# Altium project Skumpad.PrjPcb
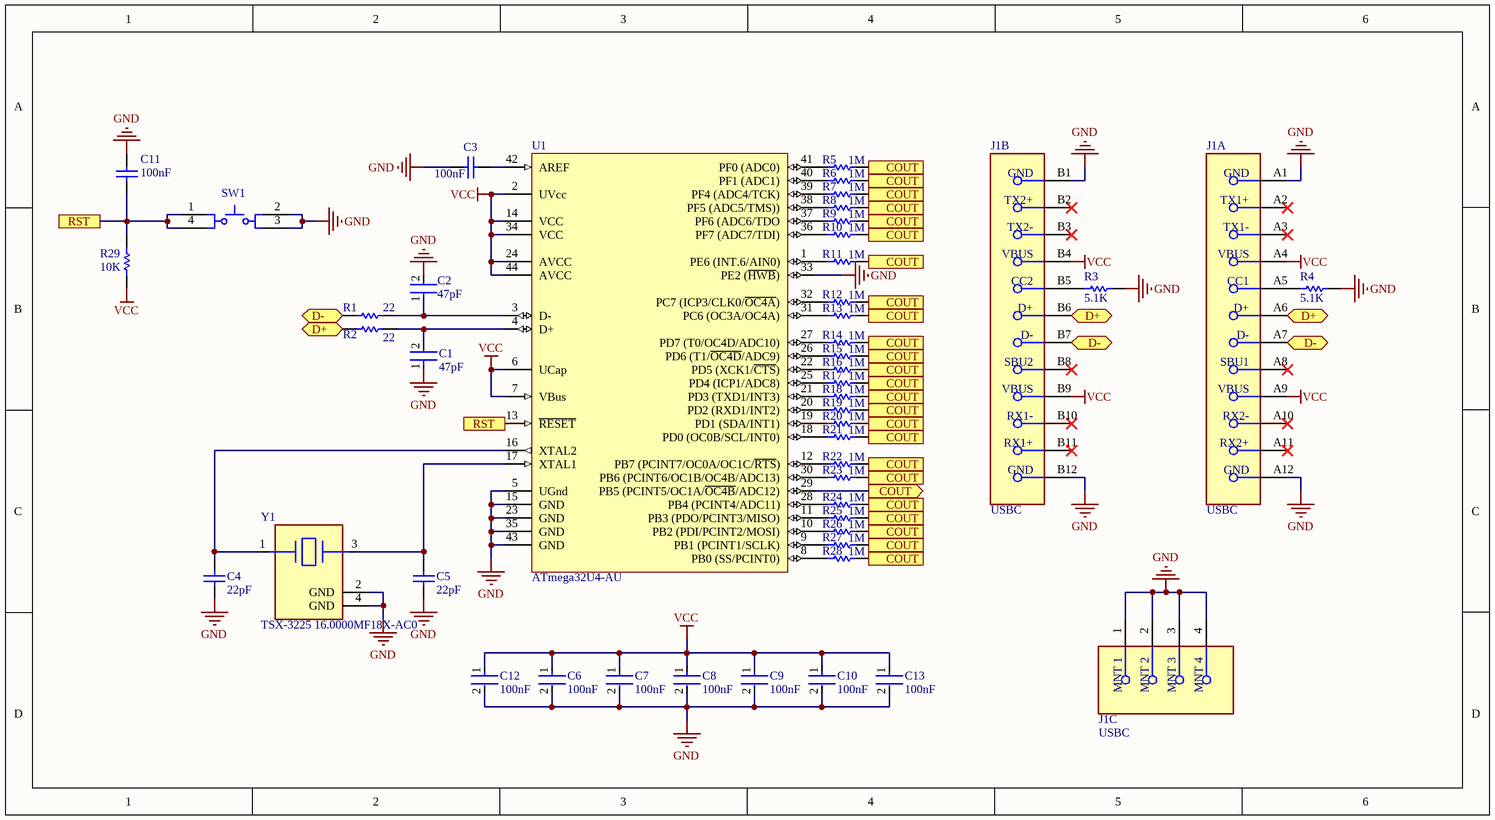
[diagram p0: Skumpad.SchDoc]
3 sheets, 118 parts. Net scope: hierarchical (ports join the sheet entries above them; power ports are global).
Board file: Skumpad.PcbDoc
Sheets:
  Skumpad.SchDoc
  Layout.SchDoc
    NUM = CSensor.SchDoc
    DIV = CSensor.SchDoc
    MUL = CSensor.SchDoc
    SUB = CSensor.SchDoc
    NUM = CSensor.SchDoc
    7 = CSensor.SchDoc
    8 = CSensor.SchDoc
    9 = CSensor.SchDoc
    ADD = CSensor.SchDoc
    a = CSensor.SchDoc
    4 = CSensor.SchDoc
    5 = CSensor.SchDoc
    6 = CSensor.SchDoc
    g = CSensor.SchDoc
    b = CSensor.SchDoc
    1 = CSensor.SchDoc
    2 = CSensor.SchDoc
    3 = CSensor.SchDoc
    ENT = CSensor.SchDoc
    c = CSensor.SchDoc
    d = CSensor.SchDoc
    e = CSensor.SchDoc
    f = CSensor.SchDoc
    DEL = CSensor.SchDoc

## Sheet Skumpad.SchDoc
size 279 x 152 mm; ApprovedBy: Skaytacium; CheckedBy: NNNI; Author: Skaytacium; CompanyName: Skaytacium Inc.; Organization: Skaytacium Inc.; DocumentNumber: Skumpad; Revision: 3

### Parts
C1  47pF  [FP-C0402-BB-MFG]
C2  47pF  [FP-C0402-BB-MFG]
C3  100nF  [CAPC1050X55X23ML05T13]
C4  22pF  [CAPC1005X56X25NL10T15]
C5  22pF  [CAPC1005X56X25NL10T15]
C6  100nF  [FP-C0402-BB-MFG]
C7  100nF  [FP-C0402-BB-MFG]
C8  100nF  [FP-C0402-BB-MFG]
C9  100nF  [FP-C0402-BB-MFG]
C10  100nF  [FP-C0402-BB-MFG]
C11  100nF  [CAPC1050X55X23ML05T13]
C12  100nF  [FP-C0402-BB-MFG]
C13  100nF  [FP-C0402-BB-MFG]
J1  USBC  [FP-1054500101-MFG]  (parts A,B,C of 3)
R1  22  [RESC1005X40X25LL05T05]
R2  22  [RESC1005X40X25LL05T05]
R3  5.1K  [RESC1005X40X25NL10T10]
R4  5.1K  [RESC1005X40X25NL10T10]
R5  1M  [RESC0402(1005)_M]
R6  1M  [RESC0402(1005)_M]
R7  1M  [RESC0402(1005)_M]
R8  1M  [RESC0402(1005)_M]
R9  1M  [RESC0402(1005)_M]
R10  1M  [RESC0402(1005)_M]
R11  1M  [RESC0402(1005)_M]
R12  1M  [RESC0402(1005)_M]
R13  1M  [RESC0402(1005)_M]
R14  1M  [RESC0402(1005)_M]
R15  1M  [RESC0402(1005)_M]
R16  1M  [RESC0402(1005)_M]
R17  1M  [RESC0402(1005)_M]
R18  1M  [RESC0402(1005)_M]
R19  1M  [RESC0402(1005)_M]
R20  1M  [RESC0402(1005)_M]
R21  1M  [RESC0402(1005)_M]
R22  1M  [RESC0402(1005)_M]
R23  1M  [RESC0402(1005)_M]
R24  1M  [RESC0402(1005)_M]
R25  1M  [RESC0402(1005)_M]
R26  1M  [RESC0402(1005)_M]
R27  1M  [RESC0402(1005)_M]
R28  1M  [RESC0402(1005)_M]
R29  10K  [RESC1005X40X25NL05T05]
SW1  7914G-1-000E  [BOUR-7914G-1-000E_V]  (value not drawn)
U1  ATmega32U4-AU  [44ML_M]
Y1  TSX-3225 16.0000MF18X-AC0  [FP-TSX-3225-MFG]

### Ports
COUT (out), D+ (bidir), D- (bidir), RST

### Nets
GND: C1.1 C2.2 C3.1 C4.1 C5.1 C6.2 C7.2 C8.2 C9.2 C10.2 C11.2 C12.2 C13.2 J1.1(MNT_1) J1.2(MNT_2) J1.3(MNT_3) J1.4(MNT_4) J1.A1(GND) J1.A12(GND) J1.B1(GND) J1.B12(GND) R3.2 R4.2 SW1.2(+) SW1.3(+) U1.5(UGnd) U1.15(GND) U1.23(GND) U1.33(PE2_(~{HWB})) U1.35(GND) U1.43(GND) Y1.2(GND) Y1.4(GND)
VCC: C6.1 C7.1 C8.1 C9.1 C10.1 C12.1 C13.1 J1.A4(VBUS) J1.A9(VBUS) J1.B4(VBUS) J1.B9(VBUS) R29.1 U1.2(UVcc) U1.6(UCap) U1.7(VBus) U1.14(VCC) U1.24(AVCC) U1.34(VCC) U1.44(AVCC)
NetC1_2: C1.2 R2.1 U1.4(D+)
NetC2_1: C2.1 R1.1 U1.3(D-)
NetC3_2: C3.2 U1.42(AREF)
NetC4_2: C4.2 U1.16(XTAL2) Y1.1
NetC5_2: C5.2 U1.17(XTAL1) Y1.3
NetC11_1: C11.1 R29.2 SW1.1(-) SW1.4(-) U1.13(~{RESET}) ; port RST
NetJ1_A5: J1.A5(CC1) R4.1
NetJ1_A6: J1.A6(D+) J1.B6(D+) R2.2 ; port D+
NetJ1_A7: J1.A7(D-) J1.B7(D-) R1.2 ; port D-
NetJ1_B5: J1.B5(CC2) R3.1
NetR5_1: R5.1 U1.41(PF0_(ADC0))
NetR5_2: R5.2 R6.2 R7.2 R8.2 R9.2 R10.2 R11.2 R12.2 R13.2 R14.2 R15.2 R16.2 R17.2 R18.2 R19.2 R20.2 R21.2 R22.2 R23.2 R24.2 R25.2 R26.2 R27.2 R28.2 U1.29(PB5_(PCINT5/OC1A/~{OC4B}/ADC12)) ; port COUT
NetR6_1: R6.1 U1.40(PF1_(ADC1))
NetR7_1: R7.1 U1.39(PF4_(ADC4/TCK))
NetR8_1: R8.1 U1.38(PF5_(ADC5/TMS)))
NetR9_1: R9.1 U1.37(PF6_(ADC6/TDO)
NetR10_1: R10.1 U1.36(PF7_(ADC7/TDI))
NetR11_1: R11.1 U1.1(PE6_(INT.6/AIN0))
NetR12_1: R12.1 U1.32(PC7_(ICP3/CLK0/~{OC4A}))
NetR13_1: R13.1 U1.31(PC6_(OC3A/OC4A))
NetR14_1: R14.1 U1.27(PD7_(T0/OC4D/ADC10))
NetR15_1: R15.1 U1.26(PD6_(T1/~{OC4D}/ADC9))
NetR16_1: R16.1 U1.22(PD5_(XCK1/~{CTS}))
NetR17_1: R17.1 U1.25(PD4_(ICP1/ADC8))
NetR18_1: R18.1 U1.21(PD3_(TXD1/INT3))
NetR19_1: R19.1 U1.20(PD2_(RXD1/INT2))
NetR20_1: R20.1 U1.19(PD1_(SDA/INT1))
NetR21_1: R21.1 U1.18(PD0_(OC0B/SCL/INT0))
NetR22_1: R22.1 U1.12(PB7_(PCINT7/OC0A/OC1C/~{RTS}))
NetR23_1: R23.1 U1.30(PB6_(PCINT6/OC1B/OC4B/ADC13))
NetR24_1: R24.1 U1.28(PB4_(PCINT4/ADC11))
NetR25_1: R25.1 U1.11(PB3_(PDO/PCINT3/MISO))
NetR26_1: R26.1 U1.10(PB2_(PDI/PCINT2/MOSI))
NetR27_1: R27.1 U1.9(PB1_(PCINT1/SCLK))
NetR28_1: R28.1 U1.8(PB0_(SS/PCINT0))

Not connected (* = marked no-connect by the designer): J1 A2(TX1+)* A3(TX1-)* A8(SBU1)* A10(RX2-)* A11(RX2+)* B2(TX2+)* B3(TX2-)* B8(SBU2)* B10(RX1-)* B11(RX1+)*

### Library data of the parts
C1 C2 = CMP-2008-03283-2: CAP CER 47PF 50V C0G/NP0 0402; Manufacturer: Kemet; Manufacturer Part Number: C0402C470J5GACTU; Temperature Coefficient: 15%; Tolerance: 0.05; Material: Ceramic; Temperature Characteristic: C0G
C3 C11 = CMP-2000-05439-1: Chip Capacitor, 100 nF, +/- 10%, 16 V, -55 to 125 degC, 0402 (1005 Metric), RoHS, Tape and Reel; Manufacturer: Samsung Electro-Mechanics; Capacitance: 100000pF; Dielectric: X7R; Rated Voltage: 16V
C4 C5 = CMP-2008-02613-1: Part Number: 04025A220JAT2A; Manufacturer: AVX Interconnect / Elco
C6-C10 C12 C13 = CMP-03020-023811-1: CAP CER 0.1UF 10V X5R 0402; Manufacturer: Kemet; Manufacturer Part Number: C0402C104K8PACTU; Material: Ceramic; Capacitance: 0.10 μF; Temperature Coefficient: 15%; Tolerance: 0.1; Value: 0.10 μF
J1 = CMP-04767-000004-1: CONN RCP USB3.1 TYPEC 24P SMD RA; Manufacturer: Molex; Manufacturer Part Number: 1054500101; Number Of Contacts: 24; Voltage Rating: 30V; Shielding: true; Is Female: yes; Current Rating: 0.25/1.25/5A; Pitch: 0.5mm; Conn Orientation: Right Angle; Package: 0; Height: 3.44mm; Footprint Url: https://www.molex.com/pdm_docs/sd/1054500101_sd.pdf; Device Class L1: Connectors; Category: Conn; Device Class L2: USB Connectors; Digikey Description: CONN RCP USB3.1 TYPEC 24P SMD RA; Contact Material: Gold,Nickel; Mouser Description: USB Shielded I/O Receptacle; Type C; Right Angle; Surface Mount; Gold over Nickel; ComponentLink2Description: Datasheet; Lead Free: Yes; Automotive: No; Temperature Range High: +85°C; RoHS: TRUE; Octopart: https://octopart.com/105450-0101-molex-68082325; ComponentLink2URL: https://www.molex.com/webdocs/datasheets/pdf/en-us/1054500101_IO_CONNECTORS.pdf; Temperature: -30°C to +85°C; Usb Standard: USB 3.1; Temperature Range Low: -30°C; Device Class L3: unset
R1 R2 = CMP-2002-08382-1: Manufacturer: Vishay Dale; Part Number: CRCW040222R0FKED
R3 R4 = CMP-2002-05812-1: Manufacturer: Panasonic; Part Number: ERA-2AEB512X
R5-R28 = CMP-1011-00849-1: 1M 0.063W 1% 0402 (1005 Metric)  SMD; Case-Metric: 1005; Value: 1000000.00 Ohm; Case-EIA: 0402
R29 = CMP-2002-01183-1: Part Number: ERT-J0ER103J; Manufacturer: Panasonic
SW1 = CMP-2000-05692-1: SPST Gull Wing Sealed Key Switch, 100 mA, 16 V, -55 to 125 degC, 4-Pin SMD, RoHS, Tape and Reel; Manufacturer: Bourns; COO: TW; Actuator Length: 1.65mm; Maximum Contact Resistance: 100mOhm; Ground Terminal: No; Mechanical Life: 100000Cycles; Contact Rating @ Voltage: 0.1A; Illumination Type: N/R; Body Orientation: Straight; Dielectric Strength: 250VAC; Maximum DC Voltage Rating: 16V; Base Material: Thermoplastic; Operating Force: 2.94N; Actuator Style: RoundButton; Switch Configuration: N.O.; Mounting: SurfaceMount,GullWing; Electrical Life: N/A; Seal Description: N/A; Datasheet Version: 08/2016; ECCN: EAR99; Product Weight: N/A; Seal Location: N/A; Actuator Color: N/A; Dimension: 5x6.2x4.19mm; Manufacturer URL: http://www.bourns.com/; Packaging: EmbossedTapeandReel; RoHS: Yes; Part No: 7914G-1-000E; Pole Throw Configuration: SPST; Supplier: Bourns; Type: KeySwitch; Mounting Technology: SurfaceMount; Datasheet URL: http://www.bourns.com/docs/Product-Datasheets/7914.pdf; Package Reference: 7914G-1-000E; Contact Material: Gold; Family: 7914; Housing Material: N/A; Minimum Insulation Resistance: 100MOhm; HTS: 8536509065; Contact Plating: N/A; Operating Temperature: -55to125C; Package Description: 4-Pin Surface Mount Device, Body 5 x 5 mm, Height 4.49 mm; Maximum AC Voltage Rating: 16V
U1 = CMP-0095-00285-2: 8-bit AVR Microcontroller, 2.7-5.5V, 16MHz, 32KB Flash, 1KB EEPROM, 2.5KB SRAM, USB Controller, 44-pin TQFP, Industrial Grade (-40°C to 85°C), Ext Osc; RevisionNote: DatasheetVersion updated. URLs added.; ComponentLink1Description: Manufacturer URL; PackageDescription: 44-Pin Plastic Thin Quad Flat Pack, 10 x 10 x 1.0 mm Body, 0.8 mm Pitch (TQFP); DatasheetVersion: revF, Nov-2010; ComponentLink2URL: http://www.atmel.com/dyn/resources/prod_documents/doc7766.pdf; ComponentLink1URL: http://www.atmel.com/; PackageReference: 44ML; ComponentLink2Description: ATmega16U4/32U4 Datasheet; PackageVersion: rev.G, Jul-2007; ComponentLink3URL: http://www.atmel.com/dyn/resources/prod_documents/7766S.pdf; ComponentLink3Description: ATmega16U4 ATmega32U4 Summary
Y1 = CMP-36405-000005-1: CRYSTAL 16.00 MHZ 9PF SMD; Manufacturer: EPSON; Stability: 18ppm; Esr: 60Ω; Frequency: 16MHz; Tolerance: 10ppm

## Sheet Layout.SchDoc
size 147 x 139 mm
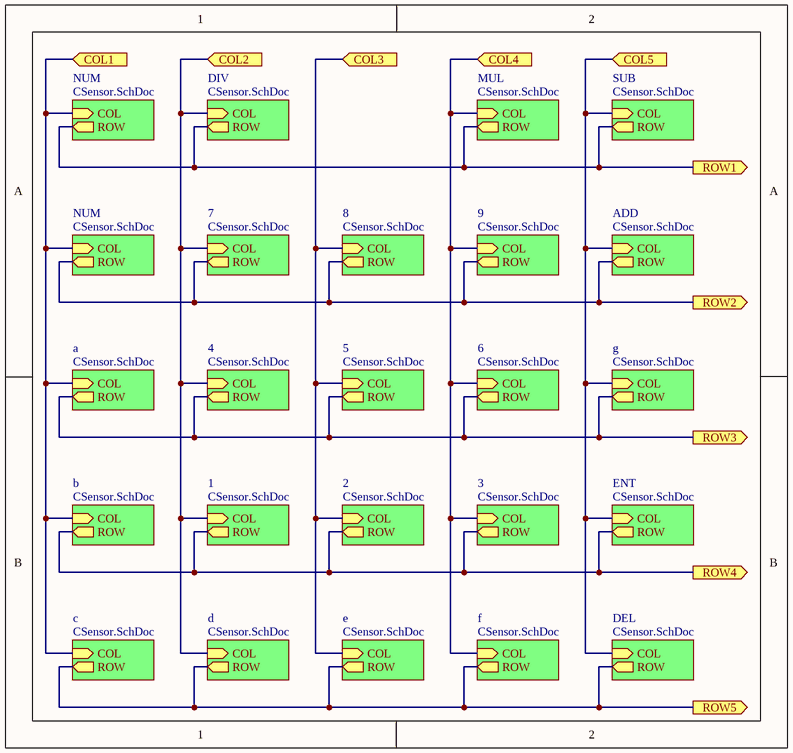
[diagram p1: Layout.SchDoc]

### Sub-sheets
1 = CSensor.SchDoc: ROW (out), COL (in)
2 = CSensor.SchDoc: ROW (out), COL (in)
3 = CSensor.SchDoc: ROW (out), COL (in)
4 = CSensor.SchDoc: ROW (out), COL (in)
5 = CSensor.SchDoc: ROW (out), COL (in)
6 = CSensor.SchDoc: ROW (out), COL (in)
7 = CSensor.SchDoc: ROW (out), COL (in)
8 = CSensor.SchDoc: ROW (out), COL (in)
9 = CSensor.SchDoc: ROW (out), COL (in)
a = CSensor.SchDoc: ROW (out), COL (in)
ADD = CSensor.SchDoc: ROW (out), COL (in)
b = CSensor.SchDoc: ROW (out), COL (in)
c = CSensor.SchDoc: ROW (out), COL (in)
d = CSensor.SchDoc: ROW (out), COL (in)
DEL = CSensor.SchDoc: ROW (out), COL (in)
DIV = CSensor.SchDoc: ROW (out), COL (in)
e = CSensor.SchDoc: ROW (out), COL (in)
ENT = CSensor.SchDoc: ROW (out), COL (in)
f = CSensor.SchDoc: ROW (out), COL (in)
g = CSensor.SchDoc: ROW (out), COL (in)
MUL = CSensor.SchDoc: ROW (out), COL (in)
NUM = CSensor.SchDoc: ROW (out), COL (in)
NUM = CSensor.SchDoc: ROW (out), COL (in)
SUB = CSensor.SchDoc: ROW (out), COL (in)

### Ports
COL1 (in), COL2 (in), COL3 (in), COL4 (in), COL5 (in), ROW1 (out), ROW2 (out), ROW3 (out), ROW4 (out), ROW5 (out)

### Nets
NetD1_1_2: port ROW4, sheet b/ROW, sheet 1/ROW, sheet 2/ROW, sheet 3/ROW, sheet ENT/ROW
NetD1_4_2: port ROW3, sheet a/ROW, sheet 4/ROW, sheet 5/ROW, sheet 6/ROW, sheet g/ROW
NetD1_7_2: port ROW2, sheet NUM/ROW, sheet 7/ROW, sheet 8/ROW, sheet 9/ROW, sheet ADD/ROW
NetD1_c_2: port ROW5, sheet c/ROW, sheet d/ROW, sheet e/ROW, sheet f/ROW, sheet DEL/ROW
NetD1_DIV_2: port ROW1, sheet NUM/ROW, sheet DIV/ROW, sheet MUL/ROW, sheet SUB/ROW
NetR1_1_2: port COL2, sheet DIV/COL, sheet 7/COL, sheet 4/COL, sheet 1/COL, sheet d/COL
NetR1_2_2: port COL3, sheet 8/COL, sheet 5/COL, sheet 2/COL, sheet e/COL
NetR1_3_2: port COL4, sheet MUL/COL, sheet 9/COL, sheet 6/COL, sheet 3/COL, sheet f/COL
NetR1_a_2: port COL1, sheet NUM/COL, sheet NUM/COL, sheet a/COL, sheet b/COL, sheet c/COL
NetR1_ADD_2: port COL5, sheet SUB/COL, sheet ADD/COL, sheet g/COL, sheet ENT/COL, sheet DEL/COL

## Sheet CSensor.SchDoc
size 50 x 50 mm
Used 24 times, as channels NUM, DIV, MUL, SUB, NUM, 7, 8, 9, ADD, a, 4, 5, 6, g, b, 1, 2, 3, ENT, c, d, e, f, DEL. Parts and nets are listed once, with the designators drawn on the sheet.
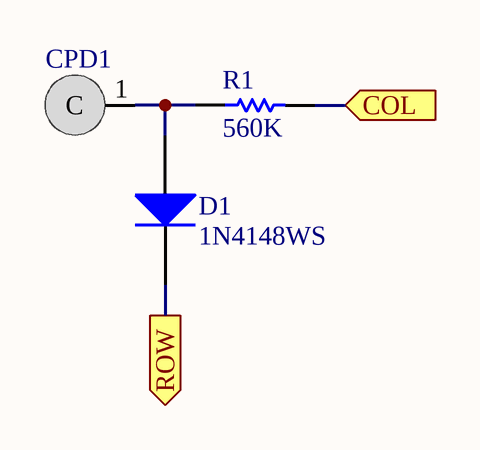
[diagram p2: CSensor.SchDoc]

### Parts
CPD1  CPAD  [CPAD]  (value not drawn)
D1  1N4148WS  [DIOD-SOD123-2_V]
R1  560K  [RESC1608X55X30NL15T15]

### Ports
COL (in), ROW (out)

### Nets
COL: R1.2 ; port COL
ROW: D1.2(K) ; port ROW
NetCPD1_1: CPD1.1 D1.1(A) R1.1

### Channels
NUM: designators end in _NUM#1; ports COL=NetR1_a_2 ROW=NetD1_DIV_2
DIV: designators end in _DIV; ports COL=NetR1_1_2 ROW=NetD1_DIV_2
MUL: designators end in _MUL; ports COL=NetR1_3_2 ROW=NetD1_DIV_2
SUB: designators end in _SUB; ports COL=NetR1_ADD_2 ROW=NetD1_DIV_2
NUM: designators end in _NUM#2; ports COL=NetR1_a_2 ROW=NetD1_7_2
7: designators end in _7; ports COL=NetR1_1_2 ROW=NetD1_7_2
8: designators end in _8; ports COL=NetR1_2_2 ROW=NetD1_7_2
9: designators end in _9; ports COL=NetR1_3_2 ROW=NetD1_7_2
ADD: designators end in _ADD; ports COL=NetR1_ADD_2 ROW=NetD1_7_2
a: designators end in _a; ports COL=NetR1_a_2 ROW=NetD1_4_2
4: designators end in _4; ports COL=NetR1_1_2 ROW=NetD1_4_2
5: designators end in _5; ports COL=NetR1_2_2 ROW=NetD1_4_2
6: designators end in _6; ports COL=NetR1_3_2 ROW=NetD1_4_2
g: designators end in _g; ports COL=NetR1_ADD_2 ROW=NetD1_4_2
b: designators end in _b; ports COL=NetR1_a_2 ROW=NetD1_1_2
1: designators end in _1; ports COL=NetR1_1_2 ROW=NetD1_1_2
2: designators end in _2; ports COL=NetR1_2_2 ROW=NetD1_1_2
3: designators end in _3; ports COL=NetR1_3_2 ROW=NetD1_1_2
ENT: designators end in _ENT; ports COL=NetR1_ADD_2 ROW=NetD1_1_2
c: designators end in _c; ports COL=NetR1_a_2 ROW=NetD1_c_2
d: designators end in _d; ports COL=NetR1_1_2 ROW=NetD1_c_2
e: designators end in _e; ports COL=NetR1_2_2 ROW=NetD1_c_2
f: designators end in _f; ports COL=NetR1_3_2 ROW=NetD1_c_2
DEL: designators end in _DEL; ports COL=NetR1_ADD_2 ROW=NetD1_c_2

### Notes on the sheet
- (in symbol CPAD) C

### Library data of the parts
D1 = CMP-2000-04932-2: Fast Switching Diode, 100 V, 0.15 A, -65 to 150 degC, 2-Pin?SOD123, RoHS, Tape and Reel; Recovery Time: 4ns; Brand: DiodesIncorporated; Unit Weight: 0.000353oz; Max Surge Current: 2A; Peak Reverse Voltage: 100V; Ir - Reverse Current: 1uA; Vf - Forward Voltage: 1.25V; Configuration: Single; If - Forward Current: 0.15A; Product Category: Diodes-GeneralPurpose,Power,Switching; Operating Temperature Range: -65Cto+150C; Packaging: Reel; Manufacturer URL: http://www.diodes.com/; Maximum Operating Temperature: +150C; Height: 1.25mm; Minimum Operating Temperature: -65C; Product: SwitchingDiodes; Package URL: http://www.diodes.com/datasheets/ds18004.pdf; Type: SwitchingDiode; Package Reference: SOD123-2; Width: 1.7mm; Datasheet URL: http://www.farnell.com/datasheets/1915529.pdf; Datasheet Version: Rev. 24-2, 10/2013; Series: 1N4148; Factory Pack Quantity: 3000; Length: 2.85mm; RoHS: True; Manufacturer: DiodesIncorporated; Mounting Style: SMD/SMT; Package / Case: SOD-123
R1 = CMP-2000-00567-1: Manufacturer: Panasonic; Part Number: ERJ3EKF5603V

## Nets that join several sheets
NetD1_1_2: b (D1_b.2), 1 (D1_1.2), 2 (D1_2.2), 3 (D1_3.2), ENT (D1_ENT.2)
NetD1_4_2: a (D1_a.2), 4 (D1_4.2), 5 (D1_5.2), 6 (D1_6.2), g (D1_g.2)
NetD1_7_2: NUM (D1_NUM#2.2), 7 (D1_7.2), 8 (D1_8.2), 9 (D1_9.2), ADD (D1_ADD.2)
NetD1_c_2: c (D1_c.2), d (D1_d.2), e (D1_e.2), f (D1_f.2), DEL (D1_DEL.2)
NetD1_DIV_2: NUM (D1_NUM#1.2), DIV (D1_DIV.2), MUL (D1_MUL.2), SUB (D1_SUB.2)
NetR1_1_2: DIV (R1_DIV.2), 7 (R1_7.2), 4 (R1_4.2), 1 (R1_1.2), d (R1_d.2)
NetR1_2_2: 8 (R1_8.2), 5 (R1_5.2), 2 (R1_2.2), e (R1_e.2)
NetR1_3_2: MUL (R1_MUL.2), 9 (R1_9.2), 6 (R1_6.2), 3 (R1_3.2), f (R1_f.2)
NetR1_a_2: NUM (R1_NUM#1.2), NUM (R1_NUM#2.2), a (R1_a.2), b (R1_b.2), c (R1_c.2)
NetR1_ADD_2: SUB (R1_SUB.2), ADD (R1_ADD.2), g (R1_g.2), ENT (R1_ENT.2), DEL (R1_DEL.2)